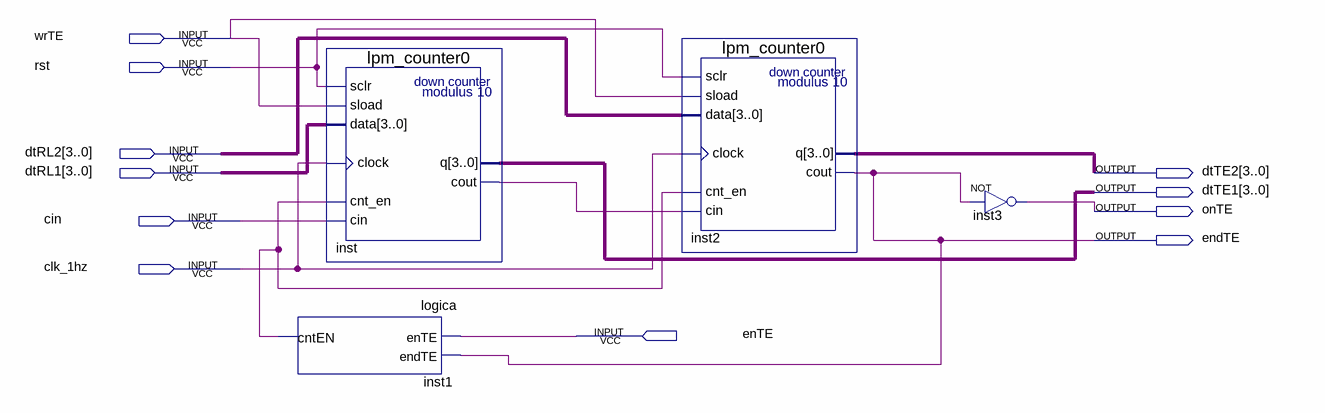
[diagram p0: schematic sheet]
// Quartus schematic historia2.bdf as structural Verilog: 4 symbols, 11 pins
module historia2 (
  input  wrTE,
  input  rst,
  input  [3:0] dtRL2,
  input  [3:0] dtRL1,
  input  cin,
  input  clk_1hz,
  input  enTE,
  output [3:0] dtTE2,
  output [3:0] dtTE1,
  output onTE,
  output endTE
);

  wire inst1_cnten, inst_cout;

  logica inst1 (.enTE(enTE), .endTE(endTE), .cntEN(inst1_cnten));
  lpm_counter0 inst (
    .sclr(rst), .sload(wrTE), .data(dtRL1), .clock(clk_1hz), .cnt_en(inst1_cnten), .cin(cin),
    .cout(inst_cout), .q(dtTE1));
  lpm_counter0 inst2 (
    .sclr(rst), .sload(wrTE), .data(dtRL2), .clock(clk_1hz), .cnt_en(inst1_cnten), .cin(inst_cout),
    .cout(endTE), .q(dtTE2));
  not inst3 (onTE, endTE);
endmodule
